# Altium project Scratch.PrjPcb
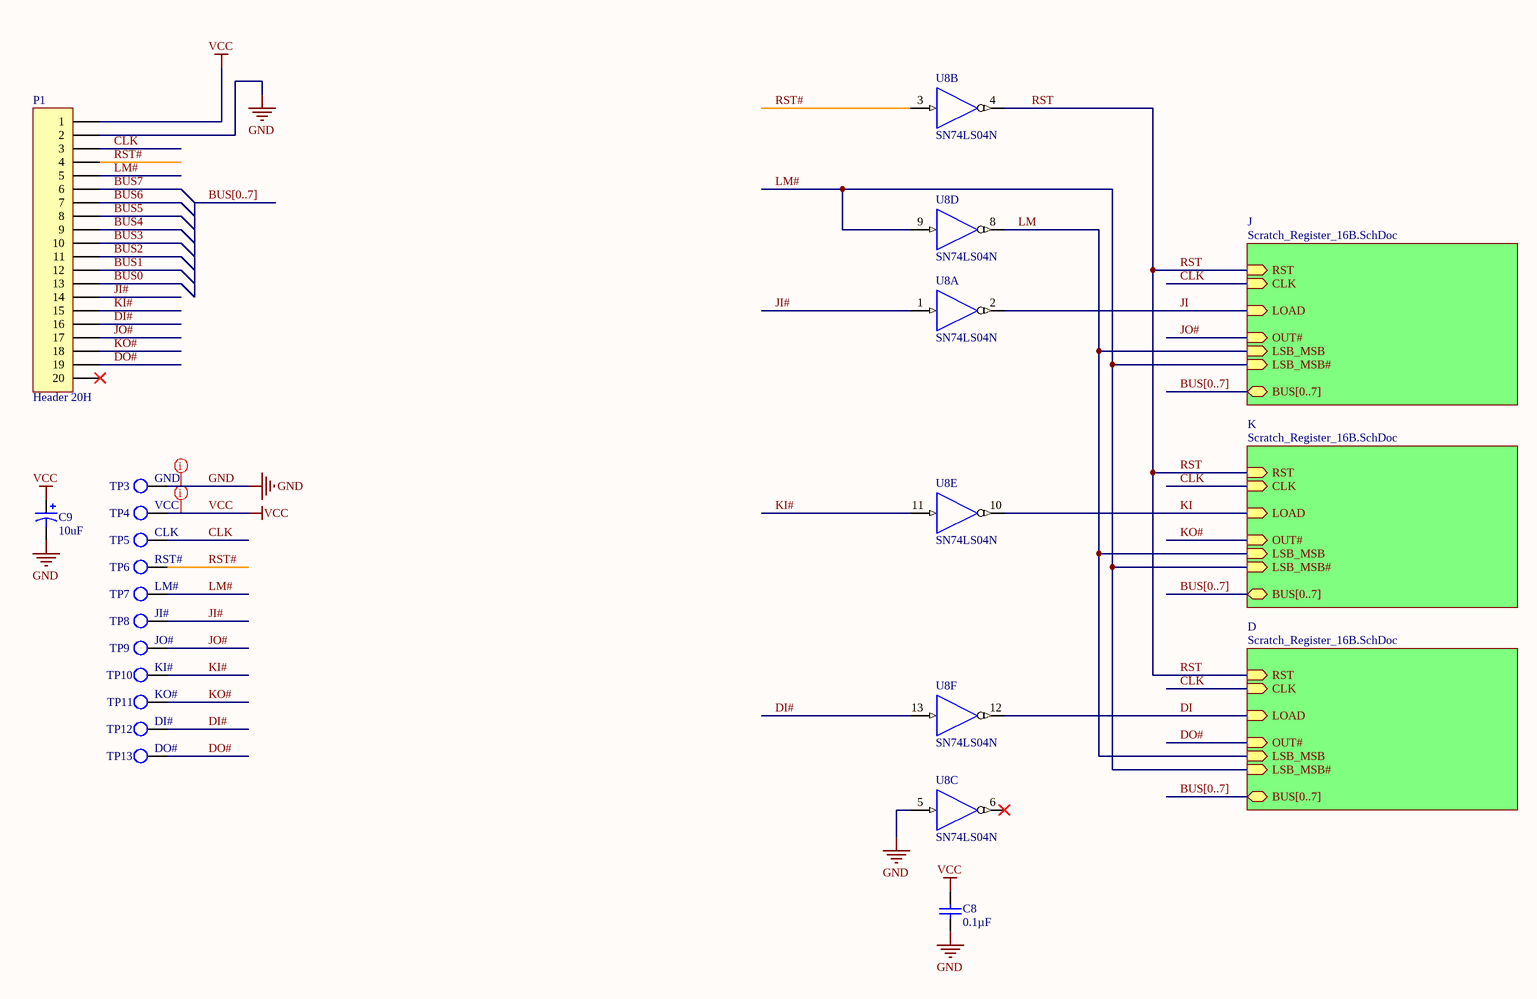
[diagram p0: Top.SchDoc]
2 sheets, 63 parts. Net scope: hierarchical (ports join the sheet entries above them; power ports are global).
Board file: Scratch.PcbDoc
Sheets:
  Top.SchDoc
    D = Scratch_Register_16B.SchDoc
    K = Scratch_Register_16B.SchDoc
    J = Scratch_Register_16B.SchDoc

## Sheet Top.SchDoc
size B; Author: E. Sims; Organization: Let's Build Rockets Inc.; SheetNumber: 1; SheetTotal: 2

### Parts
C8  Capacitance: 0.1µF  [VISH-K104K15X7RF5TL2]  (hidden comment: K104K15X7RF5TL2)
C9  value 10uF  [C5x7]  (hidden comment: Cap Pol5)
P1  Header 20H  [HDR1X20H]
TP3  GND  [KSTN-5011_V]  (no BOM)
TP4  VCC  [KSTN-5011_V]  (no BOM)
TP5  CLK  [KSTN-5011_V]  (no BOM)
TP6  RST#  [KSTN-5011_V]  (no BOM)
TP7  LM#  [KSTN-5011_V]  (no BOM)
TP8  JI#  [KSTN-5011_V]  (no BOM)
TP9  JO#  [KSTN-5011_V]  (no BOM)
TP10  KI#  [KSTN-5011_V]  (no BOM)
TP11  KO#  [KSTN-5011_V]  (no BOM)
TP12  DI#  [KSTN-5011_V]  (no BOM)
TP13  DO#  [KSTN-5011_V]  (no BOM)
U8  SN74LS04N  [N014]  (parts A,B,C,D,E,F of 6)

### Sub-sheets
D = Scratch_Register_16B.SchDoc: RST (in), BUS[0..7] (bidir), CLK (in), OUT# (in), LSB_MSB (in), LOAD (in), LSB_MSB# (in)
J = Scratch_Register_16B.SchDoc: RST (in), BUS[0..7] (bidir), CLK (in), OUT# (in), LSB_MSB (in), LOAD (in), LSB_MSB# (in)
K = Scratch_Register_16B.SchDoc: RST (in), BUS[0..7] (bidir), CLK (in), OUT# (in), LSB_MSB (in), LOAD (in), LSB_MSB# (in)

### Nets
GND: C8.2 C9.2 P1.2 TP3.1 U8.5(A) U8.7(GND)
VCC: C8.1 C9.1 P1.1 TP4.1 U8.14(VCC)
BUS0: P1.13
BUS1: P1.12
BUS2: P1.11
BUS3: P1.10
BUS4: P1.9
BUS5: P1.8
BUS6: P1.7
BUS7: P1.6
CLK: P1.3 TP5.1 ; sheet D/CLK, sheet K/CLK, sheet J/CLK
DI: U8.12(Y) ; sheet D/LOAD
DI#: P1.16 TP12.1 U8.13(A)
DO#: P1.19 TP13.1 ; sheet D/OUT#
JI: U8.2(Y) ; sheet J/LOAD
JI#: P1.14 TP8.1 U8.1(A)
JO#: P1.17 TP9.1 ; sheet J/OUT#
KI: U8.10(Y) ; sheet K/LOAD
KI#: P1.15 TP10.1 U8.11(A)
KO#: P1.18 TP11.1 ; sheet K/OUT#
LM: U8.8(Y) ; sheet D/LSB_MSB, sheet K/LSB_MSB, sheet J/LSB_MSB
LM#: P1.5 TP7.1 U8.9(A) ; sheet D/LSB_MSB#, sheet K/LSB_MSB#, sheet J/LSB_MSB#
RST: U8.4(Y) ; sheet D/RST, sheet K/RST, sheet J/RST
RST#: P1.4 TP6.1 U8.3(A)

Not connected (* = marked no-connect by the designer): P1 20*; U8 6(Y)*

### Buses and harness runs
bus BUS[0..7]
bus BUS[0..7] = sheet D/BUS[0..7]
bus BUS[0..7] = sheet J/BUS[0..7]
bus BUS[0..7] = sheet K/BUS[0..7]

### Layout directives
rule Width Constraint [Pref Width = 20mil    Min Width = 20mil    Max Width = 50mil]; rule Routing Via Style [Pref Size = 35mil    Pref Hole Size = 20mil]; net class PWR: GND, VCC

### Notes on the sheet
- Let's Build Rocket's Inc. Modular Paylaod System Based on TMP-010 Rev
  For more information visit https://github.com/LetsBuildRockets/Modular-Payload-System
  This work is licensed under CC BY-NC 4.0. To view a copy of this license, visit https://creativecommons.org/licenses/by-nc/4.0
- Title
- Size:
- Date:
- Assembly Variant:
- B
- Number:
- Time:
- Revision:
- Sheet
- of
- Author:
- File:

### Library data of the parts
C8 = CMP-2000-06508-1: Ceramic Capacitor, 100 nF, +/- 10%, 50 V, -55 to 125 degC, 2-Pin THD, RoHS, Tape and Reel; Manufacturer: Vishay; Other Names: BC1084CT; Catalog Drawings: Mono-KapSide2-15_5.58Mono-KapSide1_15; Temperature Coefficient: X7R; Voltage - Rated: 50V; Online Catalog: Mono-Kap™Series; Size / Dimension: 0.157"Lx0.098"W(4.00mmx2.50mm); Operating Temperature: -55°C~125°C; Family: CeramicCapacitors; Manufacturer URL: http://www.vishay.com/; Standard Package: 1; Thickness (Max): -; Ratings: -; Datasheet Version: 08/2013; Package Description: 2-Pin Through Hole Device, Body 4 x 2.6 mm; Mounting Type: ThroughHole; Features: -; Lead Spacing: 0.098"(2.50mm); Tolerance: ±10%; Category: Capacitors; Mounting Technology: ThroughHole; Lead Style: Straight; Datasheet URL: http://www.vishay.com/docs/45171/kseries.pdf; Applications: GeneralPurpose; Package / Case: Radial; Height - Seated (Max): 0.220"(5.58mm); Package Reference: K104K15X7RF5TL2; Series: Mono-Kap™K; Packaging: CutTape(CT)
C9 = Cap Pol5: Polarized Capacitor; Published: 8-Jun-2000; LatestRevisionDate: 17-Jul-2002; LatestRevisionNote: Re-released for DXP Platform.; PackageReference: POLAR0.8; Publisher: Altium Limited; PackageDescription: Polarized Capacitor; 2 Leads
P1 = Header 20H: Header, 20-Pin, Right Angle; System: Connector; LatestRevisionDate: 17-Jul-2002; LatestRevisionNote: Re-released for DXP Platform.; Publisher: Altium Limited
TP3-TP13 = TP
U8 = SN74LS04N: Hex Inverter; Published: 8-Jun-2000; LatestRevisionDate: 04-Mar-2005; LatestRevisionNote: Stylized 3D Model Added.; DatasheetVersion: Mar-1988; PackageVersion: Oct-1995; PackageReference: N014; Publisher: Altium Limited; PackageDescription: DIP; 14 Leads; Row Spacing 7.62 mm; Pitch 2.54 mm; ComponentLink1Description: Manufacturer Link; ComponentLink1URL: http://www.ti.com/; ComponentLink2Description: Datasheet; ComponentLink2URL: http://www-s.ti.com/sc/ds/sn74ls04.pdf

## Sheet Scratch_Register_16B.SchDoc
size B; Author: E. Sims; Organization: Let's Build Rockets Inc.; SheetNumber: 2; SheetTotal: 2
Used 3 times, as channels D, K, J. Parts and nets are listed once, with the designators drawn on the sheet.
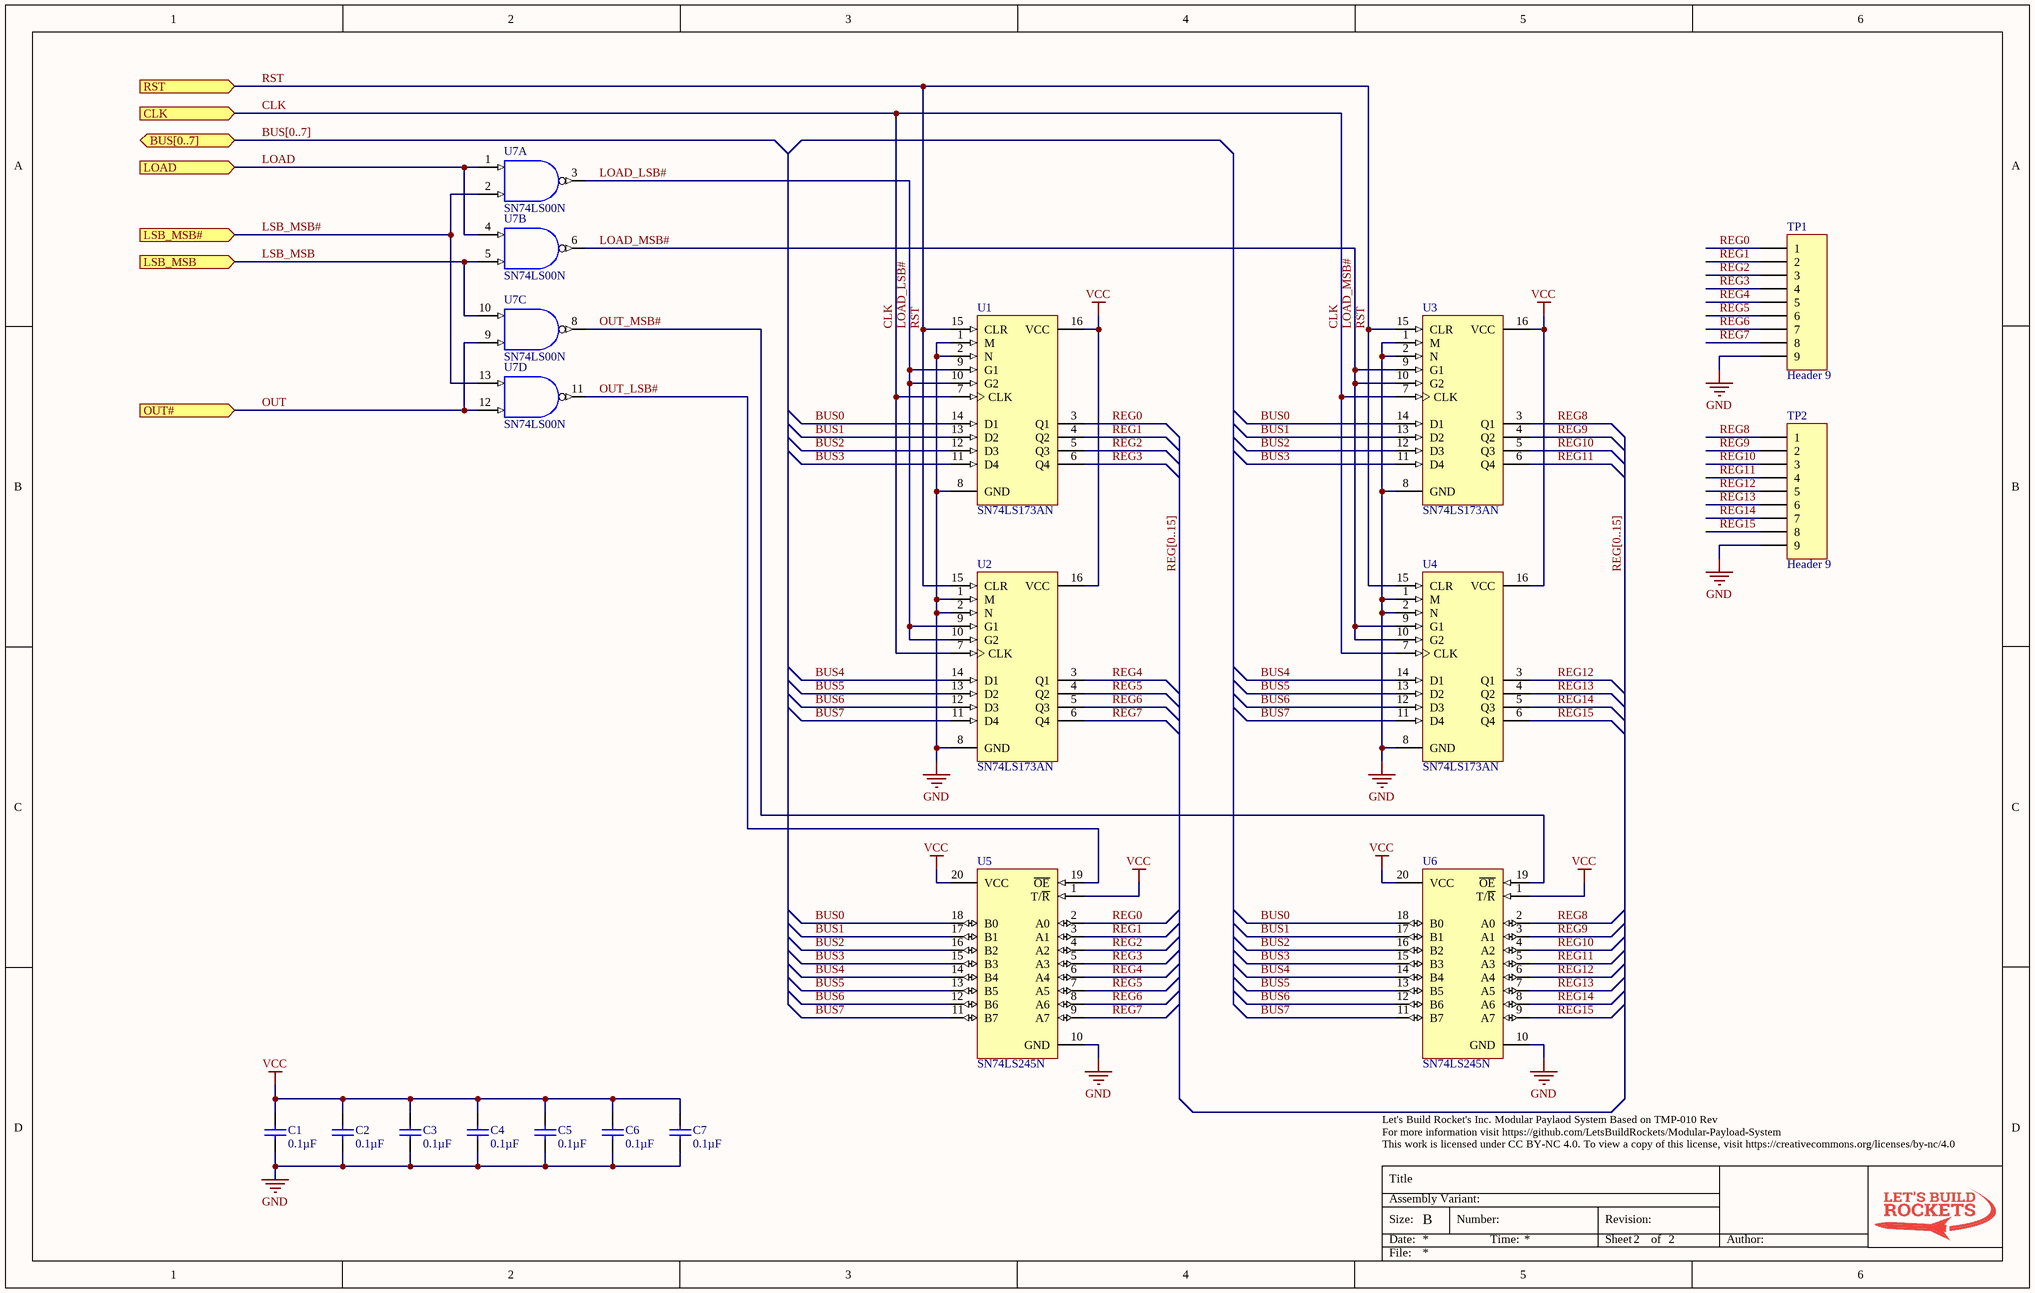
[diagram p1: Scratch_Register_16B.SchDoc]

### Parts
C1  Capacitance: 0.1µF  [VISH-K104K15X7RF5TL2]  (hidden comment: K104K15X7RF5TL2)
C2  Capacitance: 0.1µF  [VISH-K104K15X7RF5TL2]  (hidden comment: K104K15X7RF5TL2)
C3  Capacitance: 0.1µF  [VISH-K104K15X7RF5TL2]  (hidden comment: K104K15X7RF5TL2)
C4  Capacitance: 0.1µF  [VISH-K104K15X7RF5TL2]  (hidden comment: K104K15X7RF5TL2)
C5  Capacitance: 0.1µF  [VISH-K104K15X7RF5TL2]  (hidden comment: K104K15X7RF5TL2)
C6  Capacitance: 0.1µF  [VISH-K104K15X7RF5TL2]  (hidden comment: K104K15X7RF5TL2)
C7  Capacitance: 0.1µF  [VISH-K104K15X7RF5TL2]  (hidden comment: K104K15X7RF5TL2)
TP1  Header 9  [HDR1X9]
TP2  Header 9  [HDR1X9]
U1  SN74LS173AN  [N016D]
U2  SN74LS173AN  [N016D]
U3  SN74LS173AN  [N016D]
U4  SN74LS173AN  [N016D]
U5  SN74LS245N  [N020]
U6  SN74LS245N  [N020]
U7  SN74LS00N  [N014]  (parts A,B,C,D of 4)

### Ports
BUS[0..7] (bidir), CLK (in), LOAD (in), LSB_MSB (in), LSB_MSB# (in), OUT# (in), RST (in)

### Nets
GND: C1.2 C2.2 C3.2 C4.2 C5.2 C6.2 C7.2 TP1.9 TP2.9 U1.1(M) U1.2(N) U1.8(GND) U2.1(M) U2.2(N) U2.8(GND) U3.1(M) U3.2(N) U3.8(GND) U4.1(M) U4.2(N) U4.8(GND) U5.10(GND) U6.10(GND) U7.7(GND)
VCC: C1.1 C2.1 C3.1 C4.1 C5.1 C6.1 C7.1 U1.16(VCC) U2.16(VCC) U3.16(VCC) U4.16(VCC) U5.1(T/~{R}) U5.20(VCC) U6.1(T/~{R}) U6.20(VCC) U7.14(VCC)
BUS0: U1.14(D1) U3.14(D1) U5.18(B0) U6.18(B0)
BUS1: U1.13(D2) U3.13(D2) U5.17(B1) U6.17(B1)
BUS2: U1.12(D3) U3.12(D3) U5.16(B2) U6.16(B2)
BUS3: U1.11(D4) U3.11(D4) U5.15(B3) U6.15(B3)
BUS4: U2.14(D1) U4.14(D1) U5.14(B4) U6.14(B4)
BUS5: U2.13(D2) U4.13(D2) U5.13(B5) U6.13(B5)
BUS6: U2.12(D3) U4.12(D3) U5.12(B6) U6.12(B6)
BUS7: U2.11(D4) U4.11(D4) U5.11(B7) U6.11(B7)
CLK: U1.7(CLK) U2.7(CLK) U3.7(CLK) U4.7(CLK) ; port CLK
LOAD: U7.1(A) U7.4(A) ; port LOAD
LOAD_LSB#: U1.9(G1) U1.10(G2) U2.9(G1) U2.10(G2) U7.3(Y)
LOAD_MSB#: U3.9(G1) U3.10(G2) U4.9(G1) U4.10(G2) U7.6(Y)
LSB_MSB: U7.5(B) U7.10(B) ; port LSB_MSB
LSB_MSB#: U7.2(B) U7.13(B) ; port LSB_MSB#
OUT: U7.9(A) U7.12(A) ; port OUT#
OUT_LSB#: U5.19(~{OE}) U7.11(Y)
OUT_MSB#: U6.19(~{OE}) U7.8(Y)
REG0: TP1.1 U1.3(Q1) U5.2(A0)
REG1: TP1.2 U1.4(Q2) U5.3(A1)
REG2: TP1.3 U1.5(Q3) U5.4(A2)
REG3: TP1.4 U1.6(Q4) U5.5(A3)
REG4: TP1.5 U2.3(Q1) U5.6(A4)
REG5: TP1.6 U2.4(Q2) U5.7(A5)
REG6: TP1.7 U2.5(Q3) U5.8(A6)
REG7: TP1.8 U2.6(Q4) U5.9(A7)
REG8: TP2.1 U3.3(Q1) U6.2(A0)
REG9: TP2.2 U3.4(Q2) U6.3(A1)
REG10: TP2.3 U3.5(Q3) U6.4(A2)
REG11: TP2.4 U3.6(Q4) U6.5(A3)
REG12: TP2.5 U4.3(Q1) U6.6(A4)
REG13: TP2.6 U4.4(Q2) U6.7(A5)
REG14: TP2.7 U4.5(Q3) U6.8(A6)
REG15: TP2.8 U4.6(Q4) U6.9(A7)
RST: U1.15(CLR) U2.15(CLR) U3.15(CLR) U4.15(CLR) ; port RST

### Channels
D: designators end in _D; ports CLK=CLK LOAD=DI LSB_MSB#=LM# LSB_MSB=LM OUT#=DO# RST=RST
K: designators end in _K; ports CLK=CLK LOAD=KI LSB_MSB#=LM# LSB_MSB=LM OUT#=KO# RST=RST
J: designators end in _J; ports CLK=CLK LOAD=JI LSB_MSB#=LM# LSB_MSB=LM OUT#=JO# RST=RST

### Buses and harness runs
bus BUS[0..7] = port BUS[0..7]
bus REG[0..15]

### Notes on the sheet
- Let's Build Rocket's Inc. Modular Paylaod System Based on TMP-010 Rev
  For more information visit https://github.com/LetsBuildRockets/Modular-Payload-System
  This work is licensed under CC BY-NC 4.0. To view a copy of this license, visit https://creativecommons.org/licenses/by-nc/4.0
- Title
- Size:
- Date:
- Assembly Variant:
- B
- Number:
- Time:
- Revision:
- Sheet
- of
- Author:
- File:

### Library data of the parts
C1-C7 = CMP-2000-06508-1: as C8 on sheet Top; Size / Dimension: 0.157"Lx0.098"W(4.00mmx2.50mm); Operating Temperature: -55°C~125°C; Family: CeramicCapacitors; Manufacturer URL: http://www.vishay.com/; Standard Package: 1; Thickness (Max): -; Ratings: -; Datasheet Version: 08/2013; Package Description: 2-Pin Through Hole Device, Body 4 x 2.6 mm; Mounting Type: ThroughHole; Features: -; Lead Spacing: 0.098"(2.50mm); Tolerance: ±10%; Category: Capacitors; Mounting Technology: ThroughHole; Lead Style: Straight; Datasheet URL: http://www.vishay.com/docs/45171/kseries.pdf; Applications: GeneralPurpose; Package / Case: Radial; Height - Seated (Max): 0.220"(5.58mm); Package Reference: K104K15X7RF5TL2; Series: Mono-Kap™K; Packaging: CutTape(CT)
TP1 TP2 = Header 9: Header, 9-Pin; LatestRevisionDate: 17-Jul-2002; LatestRevisionNote: Re-released for DXP Platform.; Publisher: Altium Limited
U1-U4 = SN74LS173AN: 4-Bit D-Type Register with 3-State Outputs; Published: 8-Jun-2000; LatestRevisionDate: 04-Mar-2005; LatestRevisionNote: Stylized 3D Model Added.; DatasheetVersion: Mar-1988; PackageVersion: Oct-1995; PackageReference: N016D; Publisher: Altium Limited; PackageDescription: DIP; 16 Leads; Row Spacing 7.62 mm; Pitch 2.54 mm; Code_JEDEC: MS-001-BB; ComponentLink1Description: Manufacturer Link; ComponentLink1URL: http://www.ti.com/; ComponentLink2Description: Datasheet; ComponentLink2URL: http://www-s.ti.com/sc/ds/sn74ls173a.pdf
U5 U6 = SN74LS245N: Octal Bus Transceiver with 3-State Outputs; Published: 8-Jun-2000; LatestRevisionDate: 04-Mar-2005; LatestRevisionNote: Stylized 3D Model Added.; DatasheetVersion: Mar-1988; PackageVersion: Oct-1995; PackageReference: N020; Publisher: Altium Limited; PackageDescription: DIP; 20 Leads; Row Spacing 7.62 mm; Pitch 2.54 mm; ComponentLink1Description: Manufacturer Link; ComponentLink1URL: http://www.ti.com/; ComponentLink2Description: Datasheet; ComponentLink2URL: http://www-s.ti.com/sc/ds/sn74ls245.pdf
U7 = SN74LS00N: Quadruple 2-Input Positive-NAND Gate; Published: 8-Jun-2000; LatestRevisionDate: 04-Mar-2005; LatestRevisionNote: Stylized 3D Model Added.; DatasheetVersion: Mar-1988; PackageVersion: Oct-1995; PackageReference: N014; Publisher: Altium Limited; PackageDescription: DIP; 14 Leads; Row Spacing 7.62 mm; Pitch 2.54 mm; ComponentLink1Description: Manufacturer Link; ComponentLink1URL: http://www.ti.com/; ComponentLink2Description: Datasheet; ComponentLink2URL: http://www-s.ti.com/sc/ds/sn74ls00.pdf

## Nets that join several sheets
GND: Top (6 pins), D (24 pins), K (24 pins), J (24 pins)
VCC: Top (5 pins), D (16 pins), K (16 pins), J (16 pins)
BUS0: Top (P1.13), D (U1_D.14 U3_D.14 U5_D.18 U6_D.18), K (U1_K.14 U3_K.14 U5_K.18 U6_K.18), J (U1_J.14 U3_J.14 U5_J.18 U6_J.18)
BUS1: Top (P1.12), D (U1_D.13 U3_D.13 U5_D.17 U6_D.17), K (U1_K.13 U3_K.13 U5_K.17 U6_K.17), J (U1_J.13 U3_J.13 U5_J.17 U6_J.17)
BUS2: Top (P1.11), D (U1_D.12 U3_D.12 U5_D.16 U6_D.16), K (U1_K.12 U3_K.12 U5_K.16 U6_K.16), J (U1_J.12 U3_J.12 U5_J.16 U6_J.16)
BUS3: Top (P1.10), D (U1_D.11 U3_D.11 U5_D.15 U6_D.15), K (U1_K.11 U3_K.11 U5_K.15 U6_K.15), J (U1_J.11 U3_J.11 U5_J.15 U6_J.15)
BUS4: Top (P1.9), D (U2_D.14 U4_D.14 U5_D.14 U6_D.14), K (U2_K.14 U4_K.14 U5_K.14 U6_K.14), J (U2_J.14 U4_J.14 U5_J.14 U6_J.14)
BUS5: Top (P1.8), D (U2_D.13 U4_D.13 U5_D.13 U6_D.13), K (U2_K.13 U4_K.13 U5_K.13 U6_K.13), J (U2_J.13 U4_J.13 U5_J.13 U6_J.13)
BUS6: Top (P1.7), D (U2_D.12 U4_D.12 U5_D.12 U6_D.12), K (U2_K.12 U4_K.12 U5_K.12 U6_K.12), J (U2_J.12 U4_J.12 U5_J.12 U6_J.12)
BUS7: Top (P1.6), D (U2_D.11 U4_D.11 U5_D.11 U6_D.11), K (U2_K.11 U4_K.11 U5_K.11 U6_K.11), J (U2_J.11 U4_J.11 U5_J.11 U6_J.11)
CLK: Top (P1.3 TP5.1), D (U1_D.7 U2_D.7 U3_D.7 U4_D.7), K (U1_K.7 U2_K.7 U3_K.7 U4_K.7), J (U1_J.7 U2_J.7 U3_J.7 U4_J.7)
DI: Top (U8.12), D (U7_D.1 U7_D.4)
DO#: Top (P1.19 TP13.1), D (U7_D.9 U7_D.12)
JI: Top (U8.2), J (U7_J.1 U7_J.4)
JO#: Top (P1.17 TP9.1), J (U7_J.9 U7_J.12)
KI: Top (U8.10), K (U7_K.1 U7_K.4)
KO#: Top (P1.18 TP11.1), K (U7_K.9 U7_K.12)
LM: Top (U8.8), D (U7_D.5 U7_D.10), K (U7_K.5 U7_K.10), J (U7_J.5 U7_J.10)
LM#: Top (P1.5 TP7.1 U8.9), D (U7_D.2 U7_D.13), K (U7_K.2 U7_K.13), J (U7_J.2 U7_J.13)
RST: Top (U8.4), D (U1_D.15 U2_D.15 U3_D.15 U4_D.15), K (U1_K.15 U2_K.15 U3_K.15 U4_K.15), J (U1_J.15 U2_J.15 U3_J.15 U4_J.15)